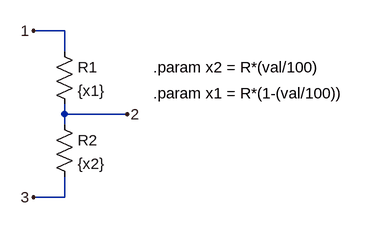
[diagram p0: schematic pot.asc]
pot.asc, the LTspice schematic file:
Version 4
SHEET 1 880 680
WIRE 192 32 144 32
WIRE 192 64 192 32
WIRE 192 160 192 144
WIRE 288 160 192 160
WIRE 192 176 192 160
WIRE 192 288 192 256
WIRE 192 288 144 288
FLAG 144 32 1
FLAG 144 288 3
FLAG 288 160 2
SYMBOL res 176 48 R0
SYMATTR InstName R1
SYMATTR Value {x1}
SYMBOL res 176 160 R0
SYMATTR InstName R2
SYMATTR Value {x2}
TEXT 328 88 Left 2 !.param x2 = R*(val/100)
TEXT 328 128 Left 2 !.param x1 = R*(1-(val/100))

The netlist it stands for:
* pot.asc
R1 1 2 {x1}
R2 2 3 {x2}
.param x2 = R*(val/100)
.param x1 = R*(1-(val/100))
.backanno
.end